# Altium schematic sheet Main.SchDoc
size 203 x 101 mm
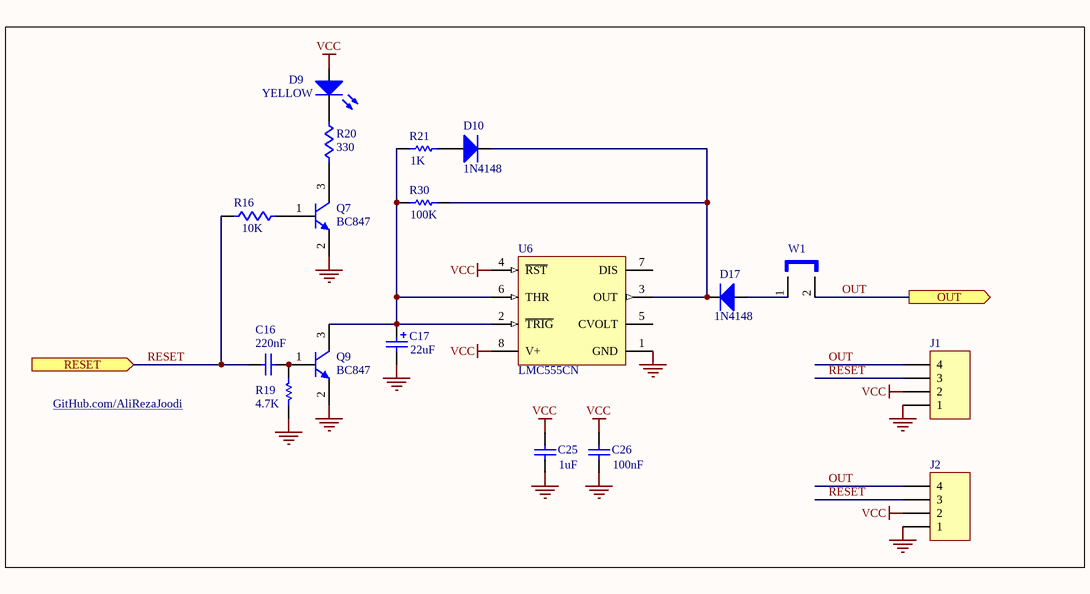
[diagram p0: Main.SchDoc]

## Parts
C16  220nF  [RESC3216N]
C17  22uF  [Cap_B]
C25  1uF  [0805]
C26  100nF  [0805]
D9  YELLOW  [0805_Diode]
D10  value 1N4148  [0805_Diode]  (hidden comment: Diode)
D17  1N4148  [0805_Diode]
J1  4PIN  [HDR1X4]  (value not drawn)
J2  4PIN  [HDR1X4]  (value not drawn)
Q7  value BC847  [SOT23-3N]  (hidden comment: NPN)
Q9  BC847  [SOT23-3N]
R16  10K  [0805]
R19  4.7K  [0805]
R20  330  [0805]
R21  1K  [0805]
R30  100K  [0805]
U6  LMC555CN  [SOP127P636-8N]
W1  Jumper 2pin  [Jumper_SMD]  (value not drawn)

## Ports
OUT (out), RESET (in)

## Nets
GND: C17.2 C25.1 C26.1 J1.1 J2.1 Q7.2(E) Q9.2(E) R19.2 U6.1(GND)
VCC: C25.2 C26.2 D9.1(A) J1.2 J2.2 U6.4(~{RST}) U6.8(V+)
OUT: J1.4 J2.4 W1.2 ; port OUT
RESET: C16.1 J1.3 J2.3 R16.1 ; port RESET
NetC16_2: C16.2 Q9.1(B) R19.1
NetC17_1: C17.1 Q9.3(C) R21.1 R30.1 U6.2(~{TRIG}) U6.6(THR)
NetD9_2: D9.2(K) R20.1
NetD10_1: D10.1(A) R21.2
NetD10_2: D10.2(K) D17.2(K) R30.2 U6.3(OUT)
NetD17_1: D17.1(A) W1.1
NetQ7_1: Q7.1(B) R16.2
NetQ7_3: Q7.3(C) R20.2

Not connected (* = marked no-connect by the designer): U6 5(CVOLT) 7(DIS)

## Notes on the sheet
- GitHub.com/AliRezaJoodi

## Library data of the parts
C16 = Cap: Capacitor; Published: 8-Jun-2000; LatestRevisionDate: 17-Jul-2002; LatestRevisionNote: Re-released for DXP Platform.; PackageReference: RAD-0.3; Publisher: Altium Limited
C17 = Cap Pol1: Polarized Capacitor (Radial); Manufacturer: Generic Components; Class I: Passive; Published: 8-Jun-2000; Revision: July-2002: Re-released for DXP Platform.; Publisher: Altium Limited; Class II: Capacitor
C25 C26 = Cap: Capacitor; Manufacturer: Generic Components; Class I: Passive; Published: 8-Jun-2000; Revision: July-2002: Re-released for DXP Platform.; Publisher: Altium Limited; Class II: Capacitor
D9 = LED: Typical INFRARED GaAs LED; Manufacturer: Generic Components; Class I: Optoelectronic; Published: 8-Jun-2000; Revision: July-2002: Re-released for DXP Platform.; Publisher: Altium Limited; Class II: LED
D10 D17 = Diode: Default Diode; Manufacturer: Generic Components; Class I: Discrete; Class II: Diode - Switching; Published: 8-Jun-2000; Revision: July-2002: Re-released for DXP Platform.; Publisher: Altium Limited
J1 J2 = Header 4: Header, 4-Pin; Manufacturer: Generic Components; Class I: Connector; Revision: July-2002: Re-released for DXP Platform.; Publisher: Altium Limited
Q7 Q9 = BC847: Silicon Bipolar Transistor
R16 R20 = Res1: Resistor; Manufacturer: Generic Components; Class I: Passive; Published: 8-Jun-2000; Revision: July-2002: Re-released for DXP Platform.; Publisher: Altium Limited; Class II: Resistor
R19 R21 R30 = Res1: Resistor; Published: 8-Jun-2000; LatestRevisionDate: 17-Jul-2002; LatestRevisionNote: Re-released for DXP Platform.; PackageReference: AXIAL-0.3; Publisher: Altium Limited
U6 = LMC555CN: CMOS Timer, 8-pin MDIP; Manufacturer: National Semiconductor; PackageTopMarking: NSUZXYTTE#*LMC*555CN; PowerWise: N; CompType: Analog IC; Published: 4-Dec-2008; DatasheetVersion: May-2006; PackageVersion: revG, May-2006; PackageReference: N08E; Publisher: Altium Limited; PackageDescription: MDIP, .365 x .250 x .130in, 8 Lead, .100in Pitch; Supplier 1: Farnell; Supplier Part Number 1: 9488243; PartNumber: LMC555CN; RoHS: N; PinCount: 8; Code_JEDEC: MS-001-BA; ComponentLink1Description: LMC555 Datasheet; ComponentLink1URL: http://www.national.com/ds/LM/LMC555.pdf; ComponentLink2Description: LMC555 Web Page; ComponentLink2URL: http://www.national.com/pf/LM/LMC555.html; ComponentLink3Description: N08E Package Page; ComponentLink3URL: http://www.national.com/packaging/folders/n08e.html
W1 = Jumper 2pin: Jumper Wire; Manufacturer: Generic Components; Published: 24-Mar-1999; Revision: July-2002: Re-released for DXP Platform.; Publisher: Altium Limited